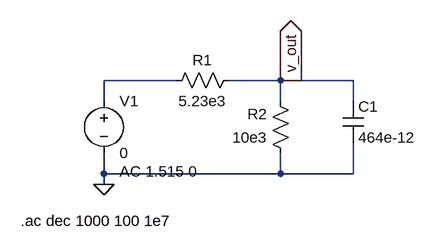
[diagram p0: schematic Analog_Prescaler.asc]
Analog_Prescaler.asc, the LTspice schematic file:
Version 4
SHEET 1 880 680
WIRE 240 64 128 64
WIRE 400 64 320 64
WIRE 416 64 400 64
WIRE 512 64 416 64
WIRE 128 96 128 64
WIRE 400 96 400 64
WIRE 512 96 512 64
WIRE 128 208 128 176
WIRE 400 208 400 176
WIRE 400 208 128 208
WIRE 512 208 512 160
WIRE 512 208 400 208
WIRE 128 224 128 208
FLAG 128 224 0
FLAG 416 64 v_out
IOPIN 416 64 Out
SYMBOL voltage 128 80 R0
WINDOW 123 24 124 Left 2
WINDOW 39 0 0 Left 0
SYMATTR InstName V1
SYMATTR Value 0
SYMATTR Value2 AC 1.515 0
SYMBOL res 336 48 R90
WINDOW 0 0 56 VBottom 2
WINDOW 3 32 56 VTop 2
SYMATTR InstName R1
SYMATTR Value 5.23e3
SYMBOL res 416 192 R180
WINDOW 0 36 76 Left 2
WINDOW 3 36 40 Left 2
SYMATTR InstName R2
SYMATTR Value 10e3
SYMBOL cap 496 96 R0
SYMATTR InstName C1
SYMATTR Value 464e-12
TEXT 0 280 Left 2 !.ac dec 1000 100 1e7

The netlist it stands for:
* Analog_Prescaler.asc
V1 N001 0 0 AC 1.515 0
R1 v_out N001 5.23e3
R2 0 v_out 10e3
C1 v_out 0 464e-12
.ac dec 1000 100 1e7
.backanno
.end

* Results of the author's LTspice run, read from the files saved beside the schematic
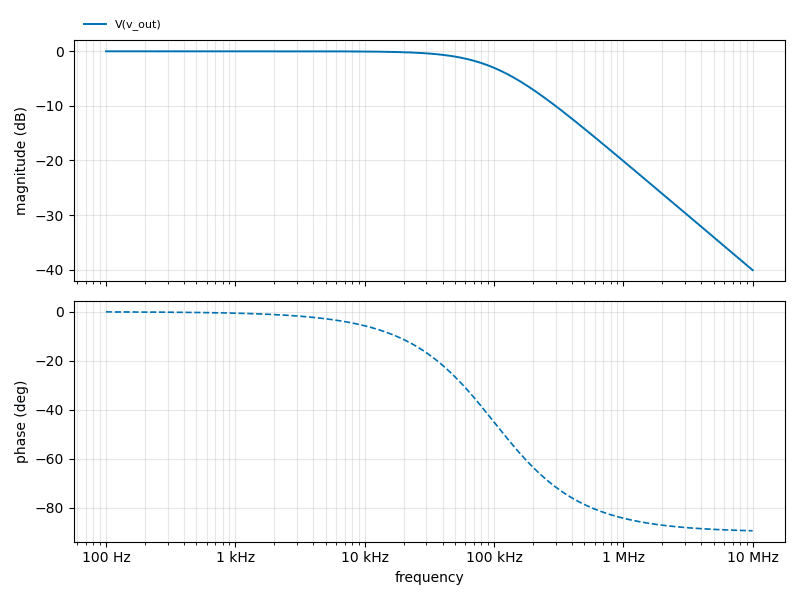
[diagram p1: AC Analysis of Analog_Prescaler.asc, plotted from the saved traces]
* AC Analysis, 1 run:
*   V(v_out): -0.05 dB at 100 Hz, -40.06 dB at 10 MHz, peak -0.05 dB at 100 Hz, 3 dB below the peak at 99.89 kHz